# EAGLE design evalboard_v1_final (EAGLE 9.6.2)
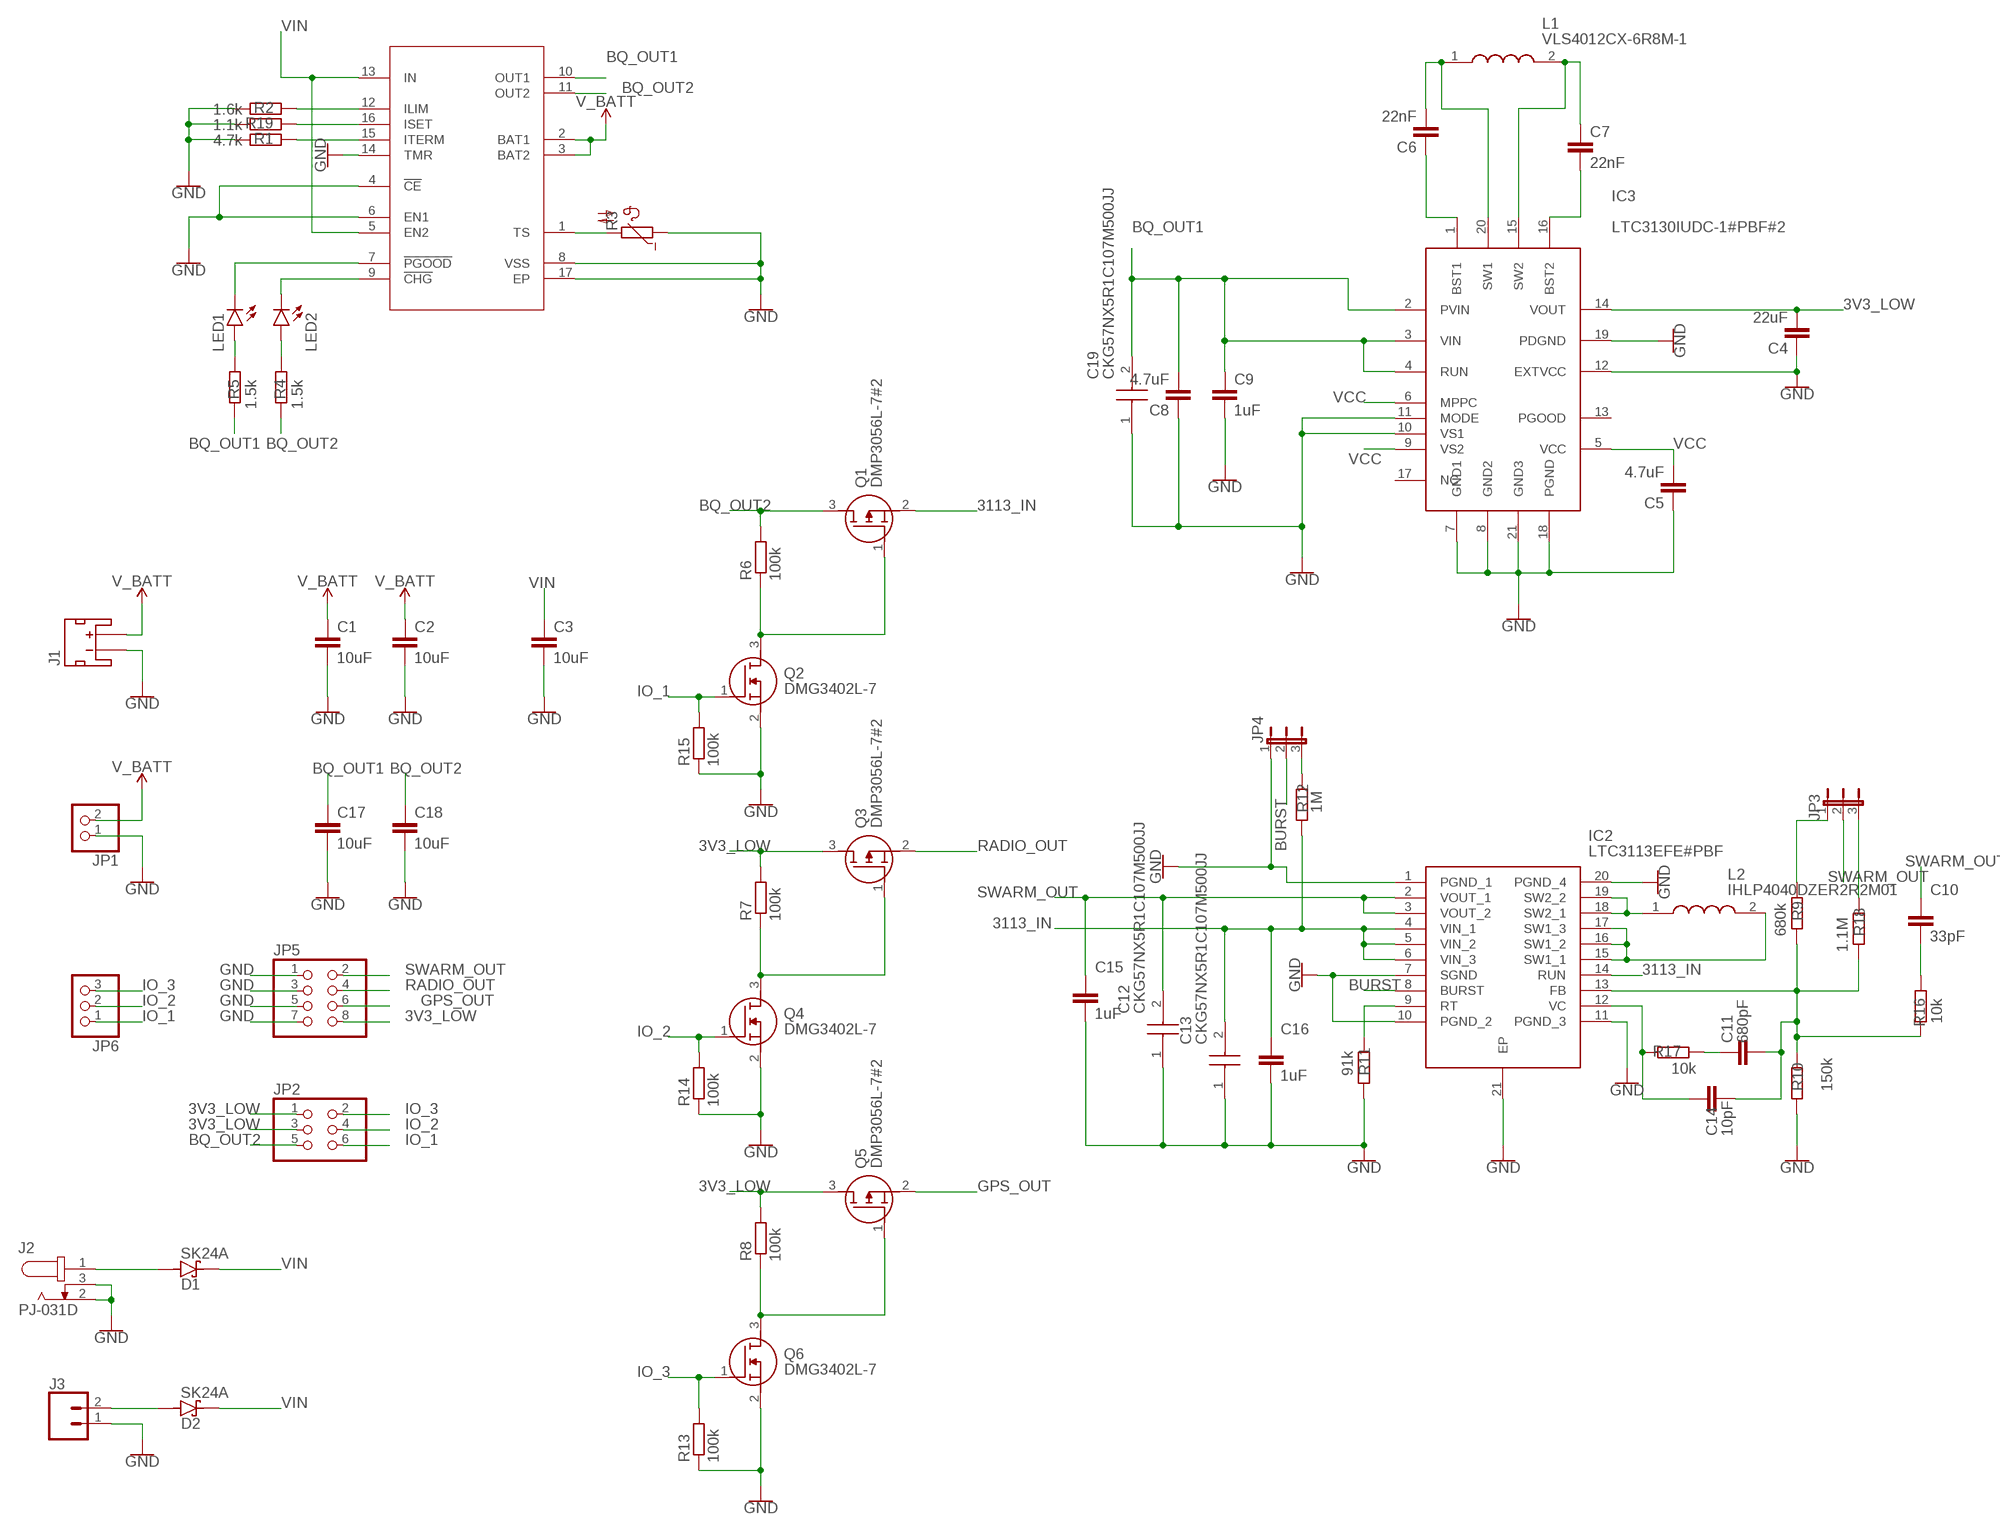
[diagram p0: schematic, sheet 1]

## Parts
C1  10uF  C-EUC1210  [C1210]
C2  10uF  C-EUC1210  [C1210]
C3  10uF  C-EUC1210  [C1210]
C4  22uF  C-EUC1210  [C1210]
C5  4.7uF  C-EUC1210  [C1210]
C6  22nF  C-EUC0603  [C0603]
C7  22nF  C-EUC0603  [C0603]
C8  4.7uF  C-EUC1210  [C1210]
C9  1uF  C-EUC0603  [C0603]
C10  33pF  C-EUC0603  [C0603]
C11  680pF  C-EUC0603  [C0603]
C12  CKG57NX5R1C107M500JJ  [CAPC6050X550N]
C13  CKG57NX5R1C107M500JJ  [CAPC6050X550N]
C14  10pF  C-EUC0603  [C0603]
C15  1uF  C-EUC0603  [C0603]
C16  1uF  C-EUC0603  [C0603]
C17  10uF  C-EUC1210  [C1210]
C18  10uF  C-EUC1210  [C1210]
C19  CKG57NX5R1C107M500JJ  [CAPC6050X550N]
D1  SK24A  [DIOM4325X250N]
D2  SK24A  [DIOM4325X250N]
IC1  BQ24074  [QFN50P300X300X100-17N]
IC2  LTC3113EFE#PBF  [SOP65P640X120-21N]
IC3  LTC3130IUDC-1#PBF#2  [QFN50P300X400X80-21N]
J1  JST_2MM_MALE  [JST-2-SMD]
J2  PJ-031D  [CUI_PJ-031D]
J3  CONN_023.5MM  [SCREWTERMINAL-3.5MM-2]
JP1  PINHD-1X2  [1X02]
JP2  PINHD-2X3  [2X03]
JP3  JP2E  [JP2]
JP4  JP2E  [JP2]
JP5  PINHD-2X4  [2X04]
JP6  PINHD-1X3  [1X03]
L1  VLS4012CX-6R8M-1  [VLS4012]
L2  IHLP4040DZER2R2M01  [INDPM108102X400N]
LED1  LEDCHIP-LED0603  [CHIP-LED0603]
LED2  LEDCHIP-LED0603  [CHIP-LED0603]
Q1  DMP3056L-7#2  [SOT96P240X100-3N]
Q2  DMG3402L-7  [SOT96P240X110-3N]
Q3  DMP3056L-7#2  [SOT96P240X100-3N]
Q4  DMG3402L-7  [SOT96P240X110-3N]
Q5  DMP3056L-7#2  [SOT96P240X100-3N]
Q6  DMG3402L-7  [SOT96P240X110-3N]
R1  4.7k  R-EU_R0603  [R0603]
R2  1.6k  R-EU_R0603  [R0603]
R3  10k  NTC640  [P640]
R4  1.5k  R-EU_R0603  [R0603]
R5  1.5k  R-EU_R0603  [R0603]
R6  100k  R-EU_R0603  [R0603]
R7  100k  R-EU_R0603  [R0603]
R8  100k  R-EU_R0603  [R0603]
R9  680k  R-EU_R0603  [R0603]
R10  150k  R-EU_R0603  [R0603]
R11  91k  R-EU_R0603  [R0603]
R12  1M  R-EU_R0603  [R0603]
R13  100k  R-EU_R0603  [R0603]
R14  100k  R-EU_R0603  [R0603]
R15  100k  R-EU_R0603  [R0603]
R16  10k  R-EU_R0603  [R0603]
R17  10k  R-EU_R0603  [R0603]
R18  1.1M  R-EU_R0603  [R0603]
R19  1.1k  R-EU_R0603  [R0603]

## Nets
3V3_LOW: C4.2 IC3.14(VOUT) JP2.1 JP2.3 JP5.8 Q3.3(D) Q5.3(D) R7.2 R8.2
3113_IN: C13.2 C16.1 IC2.4(VIN_1) IC2.5(VIN_2) IC2.6(VIN_3) IC2.14(RUN) Q1.2(S) R12.1
BQ_OUT1: C8.2 C9.1 C17.1 C19.2 IC1.10(OUT1) IC3.2(PVIN) IC3.3(VIN) IC3.4(RUN) R5.2
BQ_OUT2: C18.1 IC1.11(OUT2) JP2.5 Q1.3(D) R4.2 R6.2
BURST: IC2.8(BURST) JP4.2
GND: C1.2 C2.2 C3.2 C4.1 C5.1 C8.1 C9.2 C12.1 C13.1 C15.2 C16.2 C17.2 C18.2 C19.1 IC1.4(!CE!) IC1.6(EN1) IC1.8(VSS) IC1.14(TMR) IC1.17(EP) IC2.1(PGND_1) IC2.7(SGND) IC2.10(PGND_2) IC2.11(PGND_3) IC2.20(PGND_4) IC2.21(EP) IC3.7(GND1) IC3.8(GND2) IC3.10(VS1) IC3.11(MODE) IC3.12(EXTVCC) IC3.18(PGND) IC3.19(PDGND) IC3.21(GND3) J1.1(-) J2.2 J2.3 J3.1 JP1.1 JP4.1 JP5.1 JP5.3 JP5.5 JP5.7 Q2.2(S) Q4.2(S) Q6.2(S) R1.2 R2.2 R3.1 R10.1 R11.1 R13.1 R14.1 R15.1 R19.2
GPS_OUT: JP5.6 Q5.2(S)
IO_1: JP2.6 JP6.1 Q2.1(G) R15.2
IO_2: JP2.4 JP6.2 Q4.1(G) R14.2
IO_3: JP2.2 JP6.3 Q6.1(G) R13.2
N$1: IC1.15(ITERM) R1.1
N$2: IC1.12(ILIM) R2.1
N$3: IC1.9(!CHG!) LED2.C
N$4: IC1.1(TS) R3.2
N$5: IC1.7(!PGOOD!) LED1.C
N$6: LED1.A R5.1
N$7: LED2.A R4.1
N$8: Q3.1(G) Q4.3(D) R7.1
N$9: D1.A J2.1
N$10: Q1.1(G) Q2.3(D) R6.1
N$11: Q5.1(G) Q6.3(D) R8.1
N$12: IC2.18(SW2_1) IC2.19(SW2_2) L2.1
N$13: IC2.15(SW1_1) IC2.16(SW1_2) IC2.17(SW1_3) L2.2
N$14: JP3.3 R18.2
N$15: C6.2 IC3.20(SW1) L1.1
N$16: C6.1 IC3.1(BST1)
N$17: C7.2 IC3.16(BST2)
N$18: IC2.9(RT) R11.2
N$19: C7.1 IC3.15(SW2) L1.2
N$20: JP4.3 R12.2
N$21: C11.1 R17.1
N$22: C10.2 R16.1
N$23: C11.2 C14.2 IC2.13(FB) R9.1 R10.2 R16.2 R18.1
N$24: C14.1 IC2.12(VC) R17.2
N$25: IC1.16(ISET) R19.1
N$26: JP3.1 R9.2
N$37: D2.A J3.2
RADIO_OUT: JP5.4 Q3.2(S)
SWARM_OUT: C10.1 C12.2 C15.1 IC2.2(VOUT_1) IC2.3(VOUT_2) JP3.2 JP5.2
V_BATT: C1.1 C2.1 IC1.2(BAT1) IC1.3(BAT2) J1.2(+) JP1.2
VCC: C5.2 IC3.5(VCC) IC3.6(MPPC) IC3.9(VS2)
VIN: C3.1 D1.C(K) D2.C(K) IC1.5(EN2) IC1.13(IN)
Unconnected: IC3.13(PGOOD) IC3.17(NC) J1.NC1(PAD1) J1.NC2(PAD2)

## Library data of the parts
C1-C11 C14-C18 = rcl:C-EU: CAPACITOR, European symbol; SPICEPREFIX: C
C12 C13 C19 = SamacSys_Parts:CKG57NX5R1C107M500JJ: Multilayer Ceramic Capacitors MLCC - SMD/SMT CKG 2220 16V 100uF 20% T:5mm AEC-Q200 Source: Datasheet <https://product.tdk.com/system/files/dam/doc/product/capacitor/ceramic/mlcc/catalog/mlcc_automotive_megacap_en.pdf>; DESCRIPTION: Multilayer Ceramic Capacitors MLCC - SMD/SMT CKG 2220 16V 100uF 20% T:5mm AEC-Q200; HEIGHT: 5.5mm; MANUFACTURER_NAME: TDK; MANUFACTURER_PART_NUMBER: CKG57NX5R1C107M500JJ; MOUSER_PART_NUMBER: 810-CKG57NX5R1C107MJ; MOUSER_PRICE-STOCK: https://www.mouser.co.uk/ProductDetail/TDK/CKG57NX5R1C107M500JJ?qs=xLDY6iXSiQbsKuTXjNfGvw%3D%3D
D1 D2 = SK24A:SK24A; DESCRIPTION: Diode Schottky 40 V - Surface Mount SMA (DO-214AC); DIGI-KEY_PART_NUMBER: 1655-SK24ATR-ND; MF: SMC Diode; MP: SK24A; PACKAGE: SMA Taiwan Semiconductor; PURCHASE-URL: https://pricing.snapeda.com/search/part/SK24A/?ref=eda
IC1 = SamacSys_Parts:BQ24074
IC2 = SamacSys_Parts:LTC3113EFE#PBF: Buck-Boost Switching Regulator IC Positive Adjustable 1.8V 1 Output 3A 20-TSSOP (0.173", 4.40mm Width) Exposed Pad Source: Datasheet <http://www.linear.com/docs/30065>; DESCRIPTION: Buck-Boost Switching Regulator IC Positive Adjustable 1.8V 1 Output 3A 20-TSSOP (0.173", 4.40mm Width) Exposed Pad; HEIGHT: 1.2mm; MANUFACTURER_NAME: Analog Devices; MANUFACTURER_PART_NUMBER: LTC3113EFE#PBF; MOUSER_PART_NUMBER: 584-LTC3113EFE#PBF; MOUSER_PRICE-STOCK: https://www.mouser.co.uk/ProductDetail/Analog-Devices-Linear-Technology/LTC3113EFEPBF?qs=hVkxg5c3xu9hNe5Vps7nKA%3D%3D
IC3 = SamacSys_Parts:LTC3130IUDC-1#PBF#2: LINEAR TECHNOLOGY - LTC3130IUDC-1#PBF - DC/DC Switching Buck-Boost Regulator, Adjustable, 2.4V-25V in, 1.8V-12V out, 600 mA, QFN-20 Source: Datasheet <https://ms.componentsearchengine.com/Datasheets/2/LTC3130IUDC-1#PBF.pdf>; DESCRIPTION: LINEAR TECHNOLOGY - LTC3130IUDC-1#PBF - DC/DC Switching Buck-Boost Regulator, Adjustable, 2.4V-25V in, 1.8V-12V out, 600 mA, QFN-20; HEIGHT: 0.8mm; MANUFACTURER_NAME: Analog Devices; MANUFACTURER_PART_NUMBER: LTC3130IUDC-1#PBF
J1 = SparkFun-Connectors:JST_2MM_MALE: JST 2MM MALE RA CONNECTOR Two pin, compact surface mount connector. Commonly used as a battery input connection point. We really like the solid locking feeling and high current rating on these small connectors. We use these all the time as battery connectors. Mates to single-cell LiPo batteries. Here is the connector we sell at SparkFun: JST Right Angle Connector - White <https://www.sparkfun.com/products/8612> (PRT-08612) Datasheet <http://www.sparkfun.com/datasheets/Prototyping/Connectors/JST-Horizontal.pdf> It was used on these SparkFun products: SparkFun MOSFET Power Controller <https://www.sparkfun.com/products/11214> (PRT-11214) SparkFun Battery Babysitter - LiPo Battery Manager <https://www.sparkfun.com/products/13777> (PRT-13777) And many, many others that required a lipo battery connection.; PROD_ID: CONN-11443; SF_ID: PRT-08612
J2 = PJ-031D:PJ-031D: 1.3 mm Center Pin, 2.0 A, Right Angle, Through Hole, Dc Power Jack Connector Check availability <https://pricing.snapeda.com/parts/PJ-031D/CUI%20Devices/view-part?ref=eda>; AVAILABILITY: In Stock; CUI_PURCHASE_URL: https://www.cuidevices.com/product/interconnect/connectors/dc-power-connectors/jacks/pj-031d?utm_source=snapeda.com&utm_medium=referral&utm_campaign=snapedaBOM; DESCRIPTION: 1.3 x 4.2 mm, 2.0 A, Horizontal, Through Hole, Dc Power Jack Connector; MF: CUI Devices; MP: PJ-031D; PACKAGE: None; PRICE: None; PURCHASE-URL: https://pricing.snapeda.com/search/part/PJ-031D/?ref=eda
J3 = SparkFun-Connectors:CONN_02: Multi connection point. Often used as Generic Header-pin footprint for 0.1 inch spaced/style header connections On any of the 0.1 inch spaced packages, you can populate with these: Break Away Headers - Straight <https://www.sparkfun.com/products/116> (PRT-00116) Break Away Male Headers - Right Angle <https://www.sparkfun.com/products/553> (PRT-00553) Female Headers <https://www.sparkfun.com/products/115> (PRT-00115) Break Away Headers - Machine Pin <https://www.sparkfun.com/products/117> (PRT-00117) Break Away Female Headers - Swiss Machine Pin <https://www.sparkfun.com/products/743> (PRT-00743) For SCREWTERMINALS and SPRING TERMINALS visit here: Screw Terimnals on SparkFun.com <https://www.sparkfun.com/search/results?term=Screw+Terminals> (5mm/3.5mm/2.54mm spacing) This device is also useful as a general connection point to wire up your design to another part of your project. Our various solder wires solder well into these plated through hole pads. Hook-Up Wire - Assortment (Stranded, 22 AWG) <https://www.sparkfun.com/products/11375> (PRT-11375) Hook-Up Wire - Assortment (Solid Core, 22 AWG) <https://www.sparkfun.com/products/11367> (PRT-11367) View the entire wire category on our website here <https://www.sparkfun.com/categories/141> Special notes: Molex polarized connector foot print use with: PRT-08233 with associated crimp pins and housings. 2.54_SCREWTERM for use with PRT-10571. 3.5mm Screw Terminal footprints for PRT-08084 5mm Screw Terminal footprints for use with PRT-08432; PROD_ID: CONN-08399
JP1 = pinhead:PINHD-1X2: PIN HEADER
JP2 = pinhead:PINHD-2X3: PIN HEADER
JP3 JP4 = jumper:JP2E: JUMPER
JP5 = pinhead:PINHD-2X4: PIN HEADER
JP6 = pinhead:PINHD-1X3: PIN HEADER
L1 = SamacSys_Parts:VLS4012CX-6R8M-1: SMD / SMT Inductors (Coils), L=6.8?H, L x W x T : Source: Datasheet <https://product.tdk.com/system/files/dam/doc/product/inductor/inductor/smd/catalog/inductor_commercial_power_vls4012cx-1_en.pdf>; DESCRIPTION: SMD / SMT Inductors (Coils), L=6.8?H, L x W x T :; HEIGHT: mm; MANUFACTURER_NAME: TDK; MANUFACTURER_PART_NUMBER: VLS4012CX-6R8M-1
L2 = SamacSys_Parts:IHLP4040DZER2R2M01: Vishay IHLP4040DZ-01 Series Shielded Wire-wound SMD Inductor 2.2 uH +/-20% 25.6A Idc Source: Datasheet <https://www.vishay.com/docs/34193/ihlp-4040dz-01.pdf>; ARROW_PART_NUMBER: IHLP4040DZER2R2M01; ARROW_PRICE-STOCK: https://www.arrow.com/en/products/ihlp4040dzer2r2m01/vishay?region=europe; DESCRIPTION: Vishay IHLP4040DZ-01 Series Shielded Wire-wound SMD Inductor 2.2 uH +/-20% 25.6A Idc; HEIGHT: 4mm; MANUFACTURER_NAME: Vishay; MANUFACTURER_PART_NUMBER: IHLP4040DZER2R2M01; MOUSER_PART_NUMBER: 70-IHLP4040DZER2R2M0; MOUSER_PRICE-STOCK: https://www.mouser.co.uk/ProductDetail/Vishay-Dale/IHLP4040DZER2R2M01?qs=25W9pqL97j%252B8m%252BOw36nwKg%3D%3D
LED1 LED2 = led:LED: LED OSRAM: - CHIPLED LG R971, LG N971, LY N971, LG Q971, LY Q971, LO R971, LY R971 LH N974, LH R974 LS Q976, LO Q976, LY Q976 LO Q996 - Hyper CHIPLED LW Q18S LB Q993, LB Q99A, LB R99A - SideLED LS A670, LO A670, LY A670, LG A670, LP A670 LB A673, LV A673, LT A673, LW A673 LH A674 LY A675 LS A676, LA A676, LO A676, LY A676, LW A676 LS A679, LY A679, LG A679 - Hyper Micro SIDELED® LS Y876, LA Y876, LO Y876, LY Y876 LT Y87S - SmartLED LW L88C, LW L88S LB L89C, LB L89S, LG L890 LS L89K, LO L89K, LY L89K LS L896, LA L896, LO L896, LY L896 - TOPLED LS T670, LO T670, LY T670, LG T670, LP T670 LSG T670, LSP T670, LSY T670, LOP T670, LYG T670 LG T671, LOG T671, LSG T671 LB T673, LV T673, LT T673, LW T673 LH T674 LS T676, LA T676, LO T676, LY T676, LB T676, LH T676, LSB T676, LW T676 LB T67C, LV T67C, LT T67C, LS T67K, LO T67K, LY T67K, LW E67C LS E67B, LA E67B, LO E67B, LY E67B, LB E67C, LV E67C, LT E67C LW T67C LS T679, LY T679, LG T679 LS T770, LO T770, LY T770, LG T770, LP T770 LB T773, LV T773, LT T773, LW T773 LH T774 LS E675, LA E675, LY E675, LS T675 LS T776, LA T776, LO T776, LY T776, LB T776 LHGB T686 LT T68C, LB T68C - Hyper Mini TOPLED® LB M676 - Mini TOPLED Santana® LG M470 LS M47K, LO M47K, LY M47K Source: http://www.osram.convergy.de LUXEON: - LUMILED® LXK2-PW12-R00, LXK2-PW12-S00, LXK2-PW14-U00, LXK2-PW14-V00 LXK2-PM12-R00, LXK2-PM12-S00, LXK2-PM14-U00 LXK2-PE12-Q00, LXK2-PE12-R00, LXK2-PE12-S00, LXK2-PE14-T00, LXK2-PE14-U00 LXK2-PB12-K00, LXK2-PB12-L00, LXK2-PB12-M00, LXK2-PB14-N00, LXK2-PB14-P00, LXK2-PB14-Q00 LXK2-PR12-L00, LXK2-PR12-M00, LXK2-PR14-Q00, LXK2-PR14-R00 LXK2-PD12-Q00, LXK2-PD12-R00, LXK2-PD12-S00 LXK2-PH12-R00, LXK2-PH12-S00 LXK2-PL12-P00, LXK2-PL12-Q00, LXK2-PL12-R00 Source: www.luxeon.com KINGBRIGHT: KA-3528ASYC Source: www.kingbright.com
Q1 Q3 Q5 = SamacSys_Parts:DMP3056L-7#2: MOSFET 30V P-Ch Enh Mode 50mOhm -10Vgs -4.3A Source: Datasheet <https://www.diodes.com/assets/Datasheets/DMP3056L.pdf>; ARROW_PART_NUMBER: DMP3056L-7; ARROW_PRICE-STOCK: https://www.arrow.com/en/products/dmp3056l-7/diodes-incorporated?region=nac; DESCRIPTION: MOSFET 30V P-Ch Enh Mode 50mOhm -10Vgs -4.3A; HEIGHT: 1mm; MANUFACTURER_NAME: Diodes Inc.; MANUFACTURER_PART_NUMBER: DMP3056L-7; MOUSER_PART_NUMBER: 621-DMP3056L-7; MOUSER_PRICE-STOCK: https://www.mouser.co.uk/ProductDetail/Diodes-Incorporated/DMP3056L-7?qs=OVC8WVYZliQTX9kMWW%252B96Q%3D%3D
Q2 Q4 Q6 = SamacSys_Parts:DMG3402L-7: Diodes Inc DMG3402L-7 N-channel MOSFET Transistor, 4 A, 30 V, 3-Pin SOT-23 Source: Datasheet <https://www.diodes.com/assets/Datasheets/DMG3402L.pdf>; ARROW_PART_NUMBER: DMG3402L-7; ARROW_PRICE-STOCK: https://www.arrow.com/en/products/dmg3402l-7/diodes-incorporated?region=nac; DESCRIPTION: Diodes Inc DMG3402L-7 N-channel MOSFET Transistor, 4 A, 30 V, 3-Pin SOT-23; HEIGHT: 1.1mm; MANUFACTURER_NAME: Diodes Inc.; MANUFACTURER_PART_NUMBER: DMG3402L-7; MOUSER_PART_NUMBER: 621-DMG3402L-7; MOUSER_PRICE-STOCK: https://www.mouser.co.uk/ProductDetail/Diodes-Incorporated/DMG3402L-7?qs=M%2FOdCRO8QQ3OmR%252BxqWZuSw%3D%3D
R1 R2 R4-R19 = rcl:R-EU_: RESISTOR, European symbol; SPICEPREFIX: R
R3 = ptc-ntc:NTC640: PHILIPS NTC; OC_FARNELL: unknown; OC_NEWARK: unknown

## Board
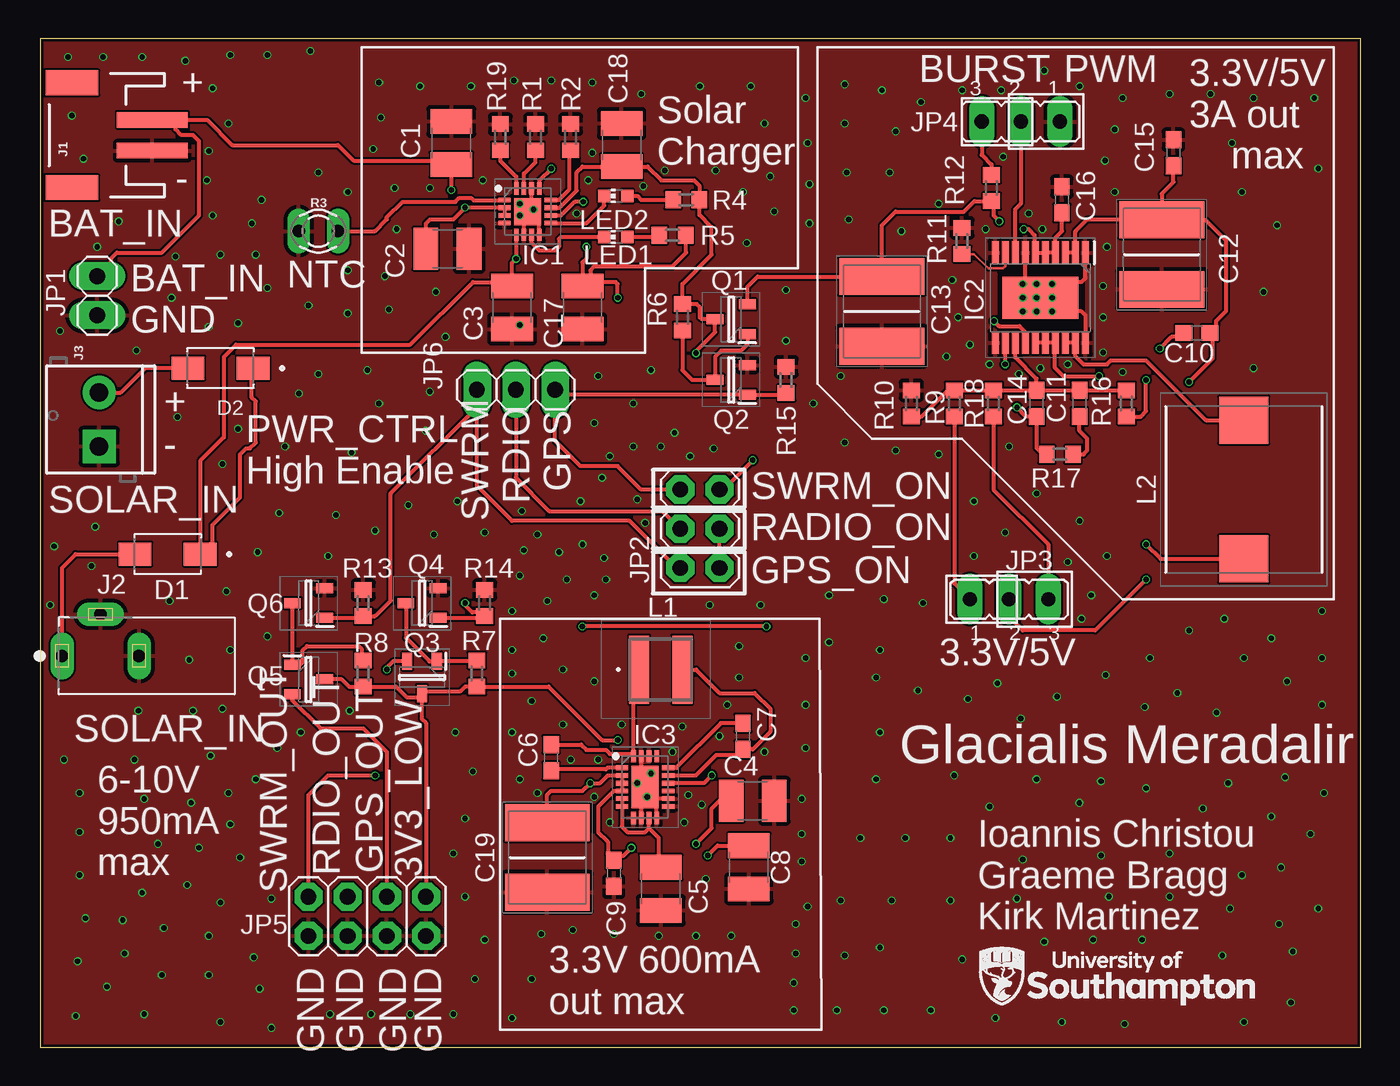
[diagram p1: board, top side]
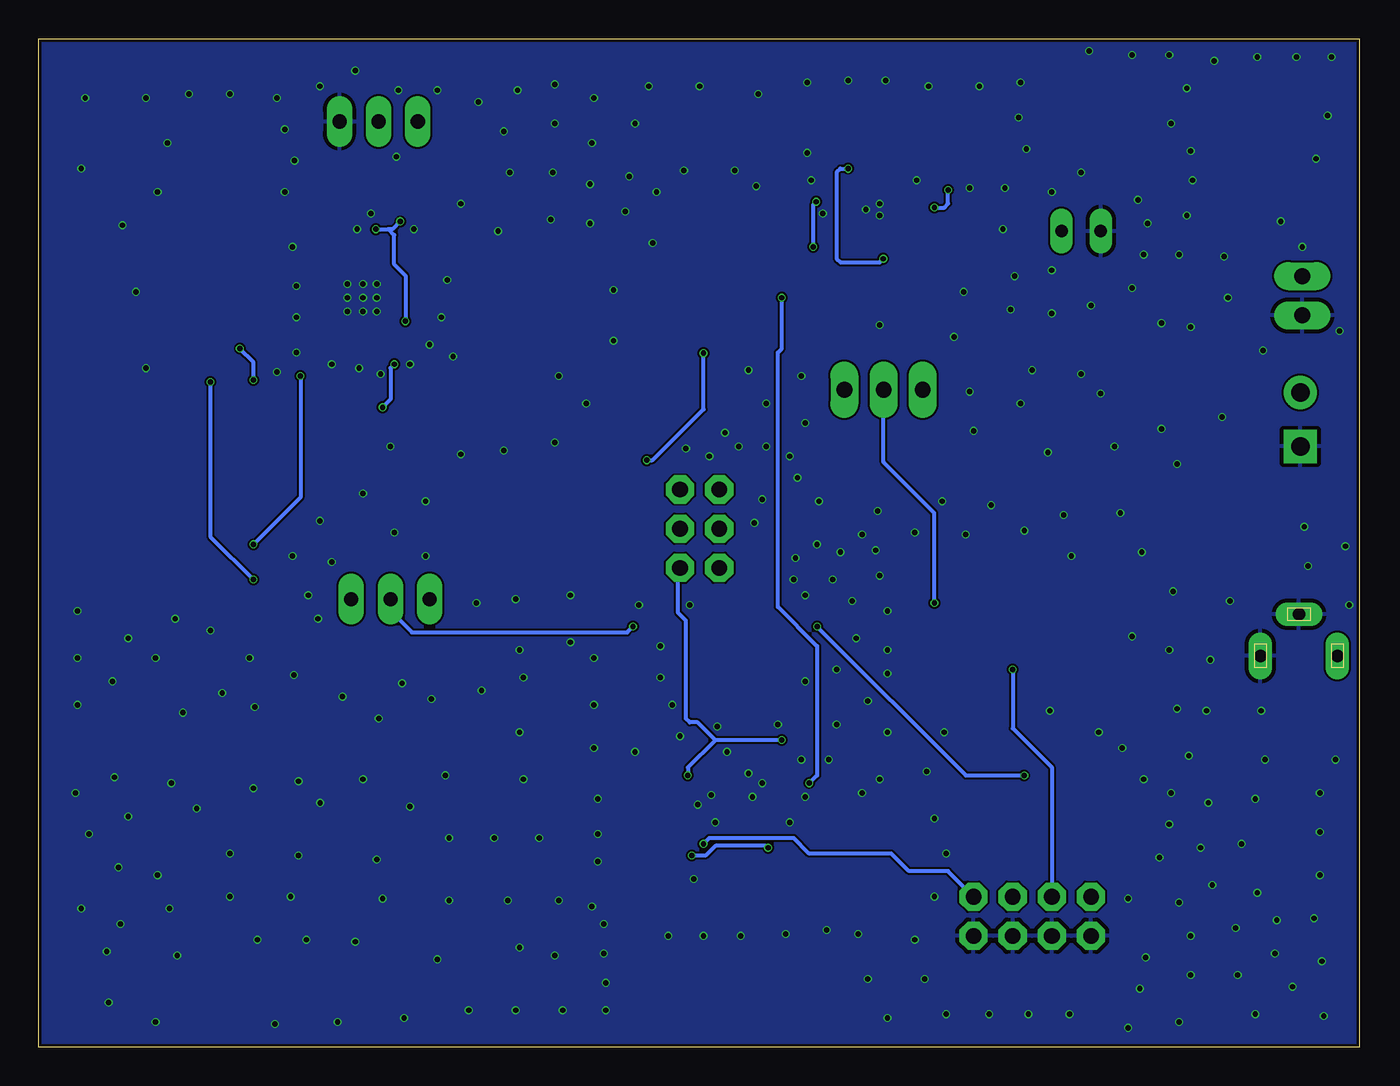
[diagram p2: board, bottom side, seen from below]

Size 85.7 x 65.46 mm. Coordinates in mm from the lower left corner, seen from the top.
Outline: 0,0 85.7,0 85.7,65.46 0,65.46 0,0
Copper layers (1*16): Top 0.035mm / dielectric 1.6mm / Bottom 0.035mm
Design rules "jlcpcb-2layers": minimum track width 5mil, minimum drill 0.3mm, track to track 5mil, track to pad 5mil, pad to pad 5mil, via to via 5mil, smd to smd 5mil, copper to edge 0.2mm, drill to drill 6mil, minimum pad ring 10mil, minimum via ring 3mil, stop-mask expansion 4mil, vias tented up to drill 0mil, thermal gap 10mil
tRestrict: area 30.6,53.2 to 32.6,55.2; area 38.2,15.4 to 40.3,18.3; area 62.2,47.1 to 67.7,50.3; area 62.2,46.2 to 67.6,47.1

### Footprints (pad centres in the part's own frame; a part is rotated, then mirrored left to right if it is on the bottom)
C1210 = smd 1.6 x 2.7: 1 -1.4,0; 2 1.4,0
C0603 = smd 1.1 x 1: 1 -0.85,0; 2 0.85,0
CAPC6050X550N = smd 2.39 x 5.51: 1 -2.26,0; 2 2.26,0
DIOM4325X250N = smd 2.12 x 1.5: A 2.115,0; C -2.115,0
QFN50P300X300X100-17N = smd 0.8 x 0.3: 1 -1.5,0.75; 2 -1.5,0.25; 3 -1.5,-0.25; 4 -1.5,-0.75; 9 1.5,-0.75; 10 1.5,-0.25; 11 1.5,0.25; 12 1.5,0.75 | smd 0.3 x 0.8: 5 -0.75,-1.5; 6 -0.25,-1.5; 7 0.25,-1.5; 8 0.75,-1.5; 13 0.75,1.5; 14 0.25,1.5; 15 -0.25,1.5; 16 -0.75,1.5 | smd 1.75 x 1.75: 17 0,0
SOP65P640X120-21N = smd 1.45 x 0.45: 1 -2.925,2.925; 2 -2.925,2.275; 3 -2.925,1.625; 4 -2.925,0.975; 5 -2.925,0.325; 6 -2.925,-0.325; 7 -2.925,-0.975; 8 -2.925,-1.625; 9 -2.925,-2.275; 10 -2.925,-2.925; 11 2.925,-2.925; 12 2.925,-2.275; 13 2.925,-1.625; 14 2.925,-0.975; 15 2.925,-0.325; 16 2.925,0.325; 17 2.925,0.975; 18 2.925,1.625; 19 2.925,2.275; 20 2.925,2.925 | smd 2.74 x 4.95: 21 0,0
QFN50P300X400X80-21N = smd 0.8 x 0.3: 1 -1.5,1.25; 2 -1.5,0.75; 3 -1.5,0.25; 4 -1.5,-0.25; 5 -1.5,-0.75; 6 -1.5,-1.25; 11 1.5,-1.25; 12 1.5,-0.75; 13 1.5,-0.25; 14 1.5,0.25; 15 1.5,0.75; 16 1.5,1.25 | smd 0.3 x 0.8: 7 -0.75,-2; 8 -0.25,-2; 9 0.25,-2; 10 0.75,-2; 17 0.75,2; 18 0.25,2; 19 -0.25,2; 20 -0.75,2 | smd 1.75 x 2.75: 21 0,0
JST-2-SMD = smd 1 x 4.6: 1 -1,-3.7; 2 1,-3.7 | smd 1.6 x 3.4: NC1 -3.4,1.5; NC2 3.4,1.5
CUI_PJ-031D = drill 0.8 pad 1.524 long: 1 0,0; 2 5,0; 3 2.5,2.7
SCREWTERMINAL-3.5MM-2 = drill 1.2 pad 2.032 square: 1 0,0 | drill 1.2 pad 2.032: 2 3.5,0
1X02 = drill 1.016 long: 1 -1.27,0; 2 1.27,0
2X03 = drill 1.016 octagon: 1 -2.54,-1.27; 2 -2.54,1.27; 3 0,-1.27; 4 0,1.27; 5 2.54,-1.27; 6 2.54,1.27
JP2 = drill 0.914 long: 1 -2.54,0; 2 0,0; 3 2.54,0
2X04 = drill 1.016 octagon: 1 -3.81,-1.27; 2 -3.81,1.27; 3 -1.27,-1.27; 4 -1.27,1.27; 5 1.27,-1.27; 6 1.27,1.27; 7 3.81,-1.27; 8 3.81,1.27
1X03 = drill 1.016 long: 1 -2.54,0; 2 0,0; 3 2.54,0
VLS4012 = smd 1.3 x 4.4: 1 -1.4,0; 2 1.4,0
INDPM108102X400N = smd 3.05 x 3.2: 1 -4.5,0; 2 4.5,0
CHIP-LED0603 = smd 0.8 x 0.8: A 0,-0.75; C 0,0.75
SOT96P240X100-3N = smd 1.1 x 0.65: 1 -1.05,0.96; 2 -1.05,-0.96; 3 1.05,0
SOT96P240X110-3N = smd 1.1 x 0.65: 1 -1.05,0.96; 2 -1.05,-0.96; 3 1.05,0
R0603 = smd 1 x 1.1: 1 -0.85,0; 2 0.85,0
P640 = drill 0.813 long: 1 -1.27,0; 2 1.27,0

### Placement (x,y rotation side)
C1  26.67,58.67 90 top
C2  26.42,51.82 0 top
C3  30.61,48.01 270 top
C4  46.23,16 180 top
C5  40.26,10.29 90 top
C6  33.15,18.8 90 top
C7  45.59,20.19 90 top
C8  45.97,11.68 90 top
C9  37.21,11.3 270 top
C10  75.06,46.35 180 top
C11  67.44,41.78 90 top
C12  72.77,51.44 90 top
C13  54.61,47.75 90 top
C14  64.64,41.78 90 top
C15  73.53,58.04 90 top
C16  66.29,54.99 90 top
C17  35.18,48.01 270 top
C18  37.72,58.55 90 top
C19  32.89,12.32 90 top
D1  8.26,32 180 top
D2  11.68,44.07 180 top
IC1  31.62,54.23 0 top
IC2  64.9,48.64 270 top
IC3  39.24,16.89 0 top
J1  3.56,59.18 90 top
J2  1.4,25.4 0 top
J3  3.81,38.99 90 top
JP1  3.68,48.77 90 top
JP2  42.8,33.66 90 top
JP3  62.87,29.08 0 top
JP4  63.63,60.07 180 top
JP5  21.21,8.51 0 top
JP6  30.86,42.67 180 top
L1  40.26,24.51 0 top
L2  78.11,36.2 270 top
LED1  37.34,52.58 90 top
LED2  37.34,55.24 90 top
Q1  44.83,47.24 180 top
Q2  44.83,43.31 180 top
Q3  24.77,24 270 top
Q4  24.77,28.83 180 top
Q5  17.4,23.88 0 top
Q6  17.4,28.83 180 top
R1  32.13,59.05 90 top
R2  34.42,59.05 90 top
R3  18.03,52.96 0 top
R4  41.91,54.99 0 top
R5  41.02,52.7 0 top
R6  41.66,47.37 90 top
R7  28.32,24.26 270 top
R8  20.95,24.26 270 top
R9  59.31,41.78 270 top
R10  56.52,41.78 270 top
R11  59.82,52.32 270 top
R12  61.72,55.75 90 top
R13  20.95,28.83 270 top
R14  28.83,28.83 270 top
R15  48.39,43.31 270 top
R16  70.48,41.78 90 top
R17  66.17,38.48 180 top
R18  61.85,41.78 270 top
R19  29.84,59.05 90 top

### Tracks (layer width: path | path; a pad name or v marks a point on that pad's centre or on a via)
3V3_LOW  (via drill 0.35)
  Top 0.152: 24.55,22.73 Q3.3
  Top 0.254: v37.47,19.94 36.45,19.94 32.98,23.41 R7.2 27.56,23.41 27.23,23.08 24.89,23.08 Q3.3 24.77,21.3 25.02,21.05 JP5.8 | v43.56,17.65 43.05,17.14 IC3.14 | JP2.1 JP2.3 | 24.55,22.73 23.75,22.73 23.07,23.41 R8.2 20.03,23.41 19.56,23.88 Q5.3 | v42.55,13.21 43.56,14.22 43.56,15.49 44.07,16 C4.2
  Bottom 0.254: v37.47,19.94 41.78,19.94 | v43.56,17.65 43.56,18.16 41.78,19.94 | JP2.1 44.2,30.99 44.2,28.19 43.69,27.69 43.69,21.34 43.43,21.08 42.93,21.08 41.78,19.94 | JP5.8 26.67,11.43 29.21,11.43 30.35,12.57 35.69,12.57 36.7,13.59 42.16,13.59 v42.55,13.21
3113_IN  (via drill 0.35)
  Top 0.152: IC2.6 64.64,51.57
  Top 0.254: 64.64,51.57 IC2.5 IC2.4 65.87,52.54 66.29,52.96 C16.1 | Q1.2 45.88,49.35 46.55,50.01 C13.2 54.61,53.34 55.5,54.23 59.94,54.23 60.62,54.9 R12.1 61.85,54.78 61.85,53.98 v62.23,53.59 | v61.89,47.12 62.22,46.79 63.54,46.79 63.92,46.41 IC2.14 | IC2.6 64.52,51.62 64.52,52.7 64.14,53.09 v63.81,53.09
  Bottom 0.254: 62.99,53.09 62.61,52.7 62.61,50.8 61.89,50.08 v61.89,47.12 | v63.81,53.09 62.99,53.09 | v62.23,53.59 62.74,53.09 62.99,53.09
BQ_OUT1  (via drill 0.35)
  Top 0.254: IC1.10 33.79,53.98 34.67,54.86 v35.22,54.86 | C17.1 35.69,49.91 35.69,50.42 35.94,50.68 41.02,50.68 41.91,51.56 41.91,52.67 R5.2 | v35.43,51.94 35.43,51.18 35.18,50.93 C17.1 | C19.2 32.89,16.38 33.15,16.64 35.18,16.64 v35.69,17.14 36.32,17.14 36.83,17.65 37.73,17.65 IC3.2 IC3.3 IC3.4 37.22,16.64 36.2,15.62 36.2,13.97 36.83,13.34 36.83,12.53 C9.1 37.5,12.45 37.85,12.45 v38.35,12.95 | v37.47,48.64 37.47,49.53 37.34,49.66 35.43,49.66 C17.1 | v43.31,12.45 43.95,13.08 C8.2
  Bottom 0.254: v35.22,54.86 35.43,54.65 v35.43,51.94 | v35.69,17.14 35.18,17.65 35.18,26.04 37.72,28.57 37.72,45.09 37.47,45.34 v37.47,48.64 | v38.35,12.95 38.48,13.08 41.78,13.08 42.42,12.45 v43.31,12.45
BQ_OUT2  (via drill 0.35)
  Top 0.152: IC1.11
  Top 0.254: IC1.11 33.7,54.48 34.8,55.59 34.8,56.77 35.18,57.15 C18.1 39.41,57.15 40.3,56.26 42.42,56.26 42.76,55.92 R4.2 42.76,54.01 43.56,53.21 43.56,51.44 41.66,49.53 R6.2 42.58,48.22 42.8,48.01 42.8,47.37 42.93,47.24 Q1.3 43.78,46.41 42.55,45.17 v42.55,45.04 | v46.23,38.1 44.32,36.2 JP2.5
  Bottom 0.254: v42.55,45.04 42.55,41.4 45.85,38.1 v46.23,38.1
BURST
  Top 0.254: JP4.2 63.63,54.74 63.25,54.36 63.25,51.59 IC2.8
GND  (via drill 0.35)
  Top 0.254: IC1.6 31.37,53.98 31.6,54.2 | 31.6,54.2 IC1.17 31.88,54.48 IC1.14 | IC3.19 38.99,17.14 IC3.21 | IC3.21 39.24,16.38 | 38.99,15.88 v39.37,16.26 39.99,15.63 IC3.10 | IC1.8 32.37,53.42 31.6,54.2 | IC3.12 39.99,16.14 IC3.21 | IC2.21 63.92,48.64 IC2.7 | IC3.8 38.99,15.37 38.99,15.36 38.99,16.64 IC3.21 | IC2.21 65.79,47.75 67.56,47.75 67.82,47.49 IC2.20 | IC2.1 67.82,49.91 67.56,49.66 65.91,49.66 IC2.21
  other vias: 43.18,10.92 8.89,40.89 20.19,38.61 10.92,58.17 58.8,44.83 22.61,47.88 26.29,46.1 19.18,34.54 12.83,40.13 18.67,31.88 3.56,33.78 8.38,28.96 15.88,38.99 9.91,21.84 59.56,47.37 62.48,57.78 10.79,56.26 41.66,20.83 41.02,19.18 42.93,15.75 51.94,43.56 37.72,20.95 33.91,20.95 42.04,16.38 41.78,14.61 36.96,14.61 31.11,17.4 36.2,18.67 83.19,25.27 83.19,28.32 81.28,6.22 78.11,1.65 70.36,1.52 65.15,6.86 66.29,1.65 61.98,1.91 57.78,2.41 54.74,2.41 51.69,2.41 48.9,2.41 48.9,4.19 49.02,6.1 49.02,8 49.78,9.14 68.96,47.37 64.9,44.07 68.96,45.09 61.59,44.32 60.33,45.59 28.7,56.26 27.94,62.36 38.99,61.85 30.73,62.74 33.15,62.74 35.81,62.61 13.84,5.84 14.99,9.65 69.22,51.94 68.96,49.4 30.61,20.45 28.07,17.91 27.56,14.86 26.8,12.57 27.56,9.78 31.88,22.48 30.61,24.26 30.61,25.78 30.61,28.32 31.11,30.61 32.64,26.54 33.91,24.51 32.89,28.96 34.16,30.35 35.94,29.34 31.37,32.26 56.95,23.15 60.2,22.61 63.75,12.19 64.64,17.4 61.59,15.62 62.1,23.63 71.75,16.81 67.43,15.87 77.09,17.14 79.88,14.99 72.01,25.27 73.79,22.99 76.33,21.72 83.19,22.23 80.9,23.75 80.26,53.34 64.14,54.1 65.02,53.09 61.34,53.09 58.29,54.74 52.45,53.72 55.88,52.96 59.18,49.78 43.43,28.7 45.34,26.04 45.34,24 44.07,20.19 46.99,19.18 34.42,18.67 25.53,33.27 27.05,35.43 54.23,24 54.48,25.78 49.66,25.27 51.18,26.29 78.11,25.27 79.88,26.54 74.55,27.05 76.83,27.81 33.66,32.13 31.24,34.8 32.26,33.27 21.72,33.53 21.97,41.78 23.11,53.09 19.94,55.5 18.03,56.77 14.35,54.99 7.87,4.7 10.92,4.7 14.22,3.81 14.99,1.27 18.8,2.16 21.46,2.16 24,2.16 26.8,2.16 30.61,1.91 32.51,7.37 28.83,6.99 34.54,7.62 37.21,7.37 11.68,1.65 4.32,3.94 2.29,2.03 5.33,8.26 2.41,5.59 8,7.75 11.68,9.4 10.92,7.24 12.32,14.48 12.95,12.32 6.6,10.03 2.92,8.38 2.54,11.18 2.54,13.97 2.54,16.51 1.52,18.67 6.35,21.84 9.78,15.88 11.05,18.92 13.97,17.4 15.37,19.43 11.81,21.97 12.32,25.78 12.06,29.59 3.3,31.24 14.1,32.13 15.49,34.67 23.88,35.18 25.02,40.01 25.27,42.55 17.4,48.13 14.73,49.28 13.97,51.44 12.83,46.99 35.05,35.43 10.92,46.74 1.27,46.48 8.51,48.64 3.68,51.94 5.08,53.59 8.76,51.31 11.68,51.44 2.79,57.66 2.03,60.45 1.78,64.26 4.06,64.26 6.6,64.26 12.19,59.94 9.4,64.01 11.18,62.23 13.72,53.47 12.32,64.39 14.73,64.39 19.94,50.42 52.2,5.97 54.48,6.48 53.21,13.59 51.94,9.53 59.82,5.71 59.05,9.53 59.05,13.59 49.4,12.06 49.4,13.84 49.4,16.13 49.66,19.43 49.66,22.23 54.48,20.45 54.23,17.4 59.31,17.65 82.42,13.84 68.83,12.45 73.28,12.57 71.5,6.99 76.71,5.97 82.93,9.02 83.31,16.51 80.77,17.53 69.13,24.17 65.97,22.76 57.28,28.83 54.74,29.08 51.18,29.34 46.74,28.7 60.58,31.88 62.61,33.4 60.58,35.43 69.22,31.88 67.44,34.16 64.64,35.94 62.87,38.99 58.29,38.48 52.2,39.24 55.5,38.73 50.16,41.78 36.7,30.35 36.58,31.75 28.83,33.4 39.24,34.04 38.73,35.56 36.45,36.96 35.94,40.51 38.48,38.99 40.26,38.99 43.69,38.86 78.74,44.07 79.38,49.02 77.98,55.5 82.93,57.02 77.34,58.67 45.85,52.2 31.11,46.86 22.35,50.04 11.18,53.98 17.53,64.64 21.97,62.61 24.64,62.36 42.8,62.36 46.1,62.36 46.99,59.94 49.66,61.59 52.2,62.48 57.15,61.34 55.12,56.77 52.2,59.94 48.39,45.85 48.39,49.15 47.37,56.52 49.78,58.67 47.62,54.23 45.59,55.5 49.91,56.01 49.91,53.47 39.62,43.94 41.15,39.88 38.48,41.78 36.2,43.56 81.15,2.92 80.39,8 70.23,43.81 66.67,44.32 63.5,43.69 22.99,55.75 25.27,55.75 82.68,61.59 78.74,61.59 75.95,61.85 73.28,61.85 70.23,61.59 69.72,59.56 69.09,57.53 69.72,55.5 67.44,62.36 65.15,63.37 62.36,62.1 59.82,62.1 55.5,59.44 54.61,62.1 44.58,22.23 35.94,23.75 10.29,12.95 6.1,18.67 12.19,16.51 39.62,17.78 38.73,17.14 19.94,47.62 43.81,56.9 40.51,56.9 39.12,55.88 35.56,56.26 31.11,54.74 31.11,53.98 32,54.36 63.75,47.75 63.75,48.64 63.75,49.53 64.64,49.53 64.64,48.64 64.64,47.75 65.66,47.75 65.66,48.64 65.66,49.53 32.26,16.51 35.94,16.26 34.8,54.1 35.81,58.04 6.73,16.13 7.62,13.21 5.46,6.1 9.53,10.54 55.24,9.53 56.13,13.59 63.37,9.65 71.67,22.08 75.44,15.49 52.32,56.77 0.89,32.51 0.64,28.7 42.16,38.35 35.18,32.64 36.96,38.35 68.2,29.34 66.67,31.5 67.56,27.81 25.65,49.02 6.73,2.16 31.88,4.45 28.19,4.45 44.83,7.24 40.13,7.24 42.55,7.24 68.33,6.99 69.34,9.78 73.28,9.78 77.22,9.02 77.98,11.18 80.52,11.68 68.83,17.27 26.92,20.45 16.89,20.45 20.07,21.84 9.65,25.15 14.73,26.67 18.03,43.69 16.76,42.42 21.21,43.94 22.1,60.33 21.59,58.29 6.22,45.21 63.63,21.34 11.81,37.85
  pour Top: 0,65.55 85.72,65.55 85.72,0 0,0
  pour Bottom: 0,65.41 85.72,65.41 85.72,-0.1 0,-0.1
GPS_OUT
  Top 0.254: Q5.2 16.35,22.54 18.18,20.7 20.95,20.7 22.48,19.18 JP5.6
IO_1
  Top 0.254: R15.2 48.28,42.35 Q2.1 33.73,42.35 JP6.1 33.4,39.37 35.05,37.72 37.47,37.72 38.99,36.2 JP2.6
IO_2  (via drill 0.35)
  Top 0.152: 28.72,27.87 R14.2
  Top 0.254: Q4.1 28.72,27.87 | R14.2 28.57,28.23 28.03,28.23 27.56,28.7 v27.56,28.83 | JP6.2 30.86,36.96 33.02,34.8 40.39,34.8 JP2.4
  Bottom 0.254: v27.56,28.83 27.56,34.67 30.86,37.97 JP6.2
IO_3
  Top 0.152: 20.84,27.87 R13.2
  Top 0.254: Q6.1 20.84,27.87 | JP2.2 41.27,31.11 38.23,34.16 30.61,34.16 28.32,36.45 JP6.3 28.32,41.53 22.73,35.94 22.73,29 21.72,27.98 R13.2
N$1
  Top 0.254: IC1.15 31.37,56.69 32.13,57.44 R1.1
N$2
  Top 0.254: R2.1 34.29,58.08 34.29,55.64 33.63,54.98 IC1.12
N$3
  Top 0.254: IC1.9 35.46,53.48 36.59,54.61 LED2.C
N$4
  Top 0.254: R3.2 21.72,52.96 22.48,53.72 22.48,53.85 23.5,54.86 26.92,54.86 27.18,55.12 27.94,55.12 28.08,54.98 IC1.1
N$5
  Top 0.254: LED1.C 33.78,52.58 33.66,52.45 33.66,51.94 33.4,51.69 32.38,51.69 31.87,52.2 IC1.7
N$6
  Top 0.254: R5.1 40.04,52.58 LED1.A
N$7
  Top 0.254: LED2.A 38.73,55.24 38.99,54.99 R4.1
N$8
  Top 0.152: R7.1 28.27,25.05
  Top 0.254: 28.27,25.05 Q3.1 25.24,25.05 23.71,26.58 Q4.3
N$9
  Top 0.254: D1.A 2.29,32 1.4,31.11 J2.1
N$10
  Top 0.254: R6.1 41.66,43.94 42.29,43.31 Q2.3 43.78,44.8 44.2,45.21 45.47,45.21 45.88,45.63 Q1.1
N$11
  Top 0.152: 20.83,25.23 R8.1
  Top 0.254: Q6.3 Q5.1 16.86,24.84 16.98,24.96 16.98,25.73 17.29,26.04 20.66,26.04 20.83,25.87 20.83,25.23
N$12
  Top 0.254: L2.1 75.64,40.7 71.75,44.58 69.47,44.58 69.22,44.32 67.69,44.32 67.17,44.84 IC2.19 IC2.18
N$13  (via drill 0.35)
  Top 0.152: IC2.17 65.82,45.66
  Top 0.254: IC2.17 IC2.16 IC2.15 | 65.82,45.66 65.82,44.13 66.39,43.56 v68.71,43.56 | v71.75,32.64 72.7,31.7 L2.2
  Bottom 0.254: v68.71,43.56 68.71,35.69 v71.75,32.64
N$14
  Top 0.254: JP3.3 65.41,32.64 61.85,36.2 R18.2
N$15
  Top 0.254: IC3.20 38.49,19.05 | 38.49,19.05 38.49,24.14 L1.1 | C6.2 35.09,19.65 35.43,19.3 36.7,19.3 36.96,19.05 38.49,19.05
N$16
  Top 0.254: IC3.1 37.72,18.16 36.83,18.16 36.7,18.03 33.23,18.03 C6.1
N$17
  Top 0.254: C7.2 44.16,21.04 41.26,18.14 IC3.16
N$18
  Top 0.152: R11.2 60.58,51.47 61.51,50.55 62.48,50.55 62.62,50.69 IC2.9
N$19
  Top 0.152: IC3.15 40.76,17.65
  Top 0.254: L1.2 42.55,24.51 44.07,22.99 46.35,22.99 47.37,21.97 47.37,20.49 46.23,19.34 C7.1 45.21,18.96 43.85,18.96 42.55,17.65 40.76,17.65
N$20
  Top 0.254: R12.2 61.72,57.28 61.09,57.91 JP4.3
N$21
  Top 0.254: R17.1 67.69,38.48 67.94,38.73 67.94,39.5 67.44,40.01 C11.1
N$22  (via drill 0.35)
  Top 0.254: v72.64,45.34 73.41,46.1 73.95,46.1 C10.2 | R16.1 71.41,40.93 71.75,41.27 v71.75,43.31
  Bottom 0.254: v71.75,43.31 71.75,44.45 v72.64,45.34
N$23
  Top 0.254: R10.2 57.19,40.93 58.89,42.63 R9.1 R18.1 C14.2 | C14.2 C11.2 R16.2 | C14.2 64.64,43.4 63.27,44.77 IC2.13
N$24  (via drill 0.35)
  Top 0.254: R17.2 65.06,38.48 64.64,38.9 C14.1 63.97,40.93 v63.37,41.53 | v62.61,44.32 62.62,44.33 IC2.12
  Bottom 0.254: v63.37,41.53 62.87,42.04 62.87,44.07 v62.61,44.32
N$25
  Top 0.254: IC1.16 30.87,56.49 29.84,57.52 R19.1
N$26
  Top 0.254: JP3.1 59.31,30.1 R9.2
N$37
  Top 0.254: D2.A 6.79,44.07 5.21,42.49 J3.2
RADIO_OUT  (via drill 0.35)
  Top 0.254: Q3.2 22.89,25.05 22.48,24.64 v22.48,24.51
  Bottom 0.254: v22.48,24.51 22.48,20.7 19.94,18.16 JP5.4
SWARM_OUT  (via drill 0.35)
  Top 0.152: v47.12,27.3 47.11,27.31 | 76.07,46.19 C10.1
  Top 0.254: IC2.3 IC2.2 67.17,52.95 67.94,53.72 72.75,53.72 C12.2 | v71.75,30.35 68.45,27.05 63.75,27.05 62.87,27.94 JP3.2 | JP5.2 17.4,16.38 18.67,17.65 21.72,17.65 v21.73,17.64 | 47.11,27.31 v35.17,27.31 | v74.55,43.18 76.07,44.7 76.07,46.19 | C10.1 76.29,46.74 76.29,47.12 76.96,47.79 76.96,52.32 75.59,53.7 C12.2 | C15.1 73.53,56.13 72.77,55.37 C12.2
  Bottom 0.152: v35.18,27.3 v35.17,27.31
  Bottom 0.254: v74.55,43.18 74.55,33.15 v71.75,30.35 | v21.73,17.64 25.52,17.64 v35.18,27.3 | v47.12,27.3 47.5,26.92 61.47,26.92 62.87,28.32 JP3.2
V_BATT  (via drill 0.35)
  Top 0.254: IC1.3 IC1.2 28.07,54.48 28.07,54.49 v27.56,54.49 v27.56,54.48 26.8,53.72 25.27,53.72 25.02,53.46 C2.1 | JP1.2 4.57,50.93 4.57,51.18 4.95,51.56 7.87,51.56 10.29,53.98 10.29,58.8 9.91,59.18 9.14,59.18 8.76,59.56 8.76,60.18 J1.2 10.81,60.18 12.45,58.55 19.3,58.55 20.32,57.53 26.67,57.53 C1.1 v26.67,55.63
  Bottom 0.254: v27.56,54.49 26.92,54.49 26.67,54.74 v26.67,55.63
VCC
  Top 0.254: IC3.5 IC3.6 37.74,14.33 38.1,13.97 39.24,13.97 39.49,14.22 | 39.49,14.22 IC3.9 | C5.2 40.13,11.81 40.13,13.58 39.49,14.22
VIN  (via drill 0.35)
  Top 0.254: v33.16,57.01 32.37,56.23 IC1.13 | IC1.5 v30.87,51.17 30.61,50.9 C3.1 30.36,49.66 28.07,49.66 24,45.59 12.7,45.59 11.89,44.79 11.89,39.58 10.37,38.06 D1.C 11.18,32.81 11.18,33.91 12.95,35.69 12.95,38.48 13.34,38.86 13.59,38.86 13.97,39.24 13.97,41.91 13.72,42.16 13.72,43.99 D2.C
  Bottom 0.254: v33.16,57.01 33.66,57.01 33.91,56.77 33.91,51.18 33.66,50.93 31.11,50.93 v30.87,51.17

### Text on the board
tPlace: BURST | PWM | + | Solar / Charger | 3.3V/5V / 3A out / max | - | BAT_IN | BAT_IN | NTC | GND | + | - | - | PWR_CTRL / High Enable | GPS | SWRM_ON | SOLAR_IN | RDIO | SWRM | RADIO_ON | GPS_ON | 3.3V/5V | SOLAR_IN | Glacialis Meradalir | 6-10V / 950mA / max | RDIO_OUT | GPS_OUT | 3V3_LOW | SWRM_OUT | Ioannis Christou / Graeme Bragg / Kirk Martinez | GND | GND | GND | GND | 3.3V 600mA / out max